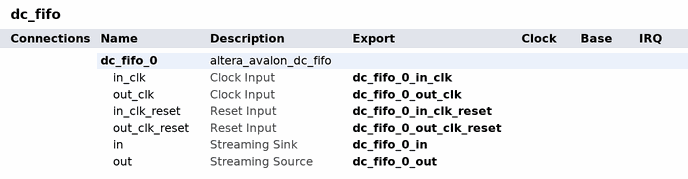
[diagram p0: system contents]
# Platform Designer (Qsys) system dc_fifo, Arria 10 10AT115S2F45E2SG
# Parameters at their usual value, and those the tool derives, are not listed.
package require -exact qsys 1.0
create_system dc_fifo
set_project_property DEVICE_FAMILY {Arria 10}
set_project_property DEVICE 10AT115S2F45E2SG

add_component dc_fifo_0 ip/dc_fifo/dc_fifo_0.ip altera_avalon_dc_fifo dc_fifo_0 17.1
load_component dc_fifo_0
set_component_parameter_value SYMBOLS_PER_BEAT 4
set_component_parameter_value BITS_PER_SYMBOL 8
set_component_parameter_value FIFO_DEPTH 16
set_component_parameter_value ERROR_WIDTH 1
set_component_parameter_value USE_PACKETS 1
save_component

# exported interfaces
add_interface dc_fifo_0_in avalon_streaming sink
set_interface_property dc_fifo_0_in EXPORT_OF dc_fifo_0.in
add_interface dc_fifo_0_in_clk clock sink
set_interface_property dc_fifo_0_in_clk EXPORT_OF dc_fifo_0.in_clk
add_interface dc_fifo_0_in_clk_reset reset sink
set_interface_property dc_fifo_0_in_clk_reset EXPORT_OF dc_fifo_0.in_clk_reset
add_interface dc_fifo_0_out avalon_streaming source
set_interface_property dc_fifo_0_out EXPORT_OF dc_fifo_0.out
add_interface dc_fifo_0_out_clk clock sink
set_interface_property dc_fifo_0_out_clk EXPORT_OF dc_fifo_0.out_clk
add_interface dc_fifo_0_out_clk_reset reset sink
set_interface_property dc_fifo_0_out_clk_reset EXPORT_OF dc_fifo_0.out_clk_reset

set_interconnect_requirement {$system} qsys_mm.clockCrossingAdapter HANDSHAKE
set_interconnect_requirement {$system} qsys_mm.insertDefaultSlave FALSE
set_interconnect_requirement {$system} qsys_mm.maxAdditionalLatency 1

save_system dc_fifo.qsys
